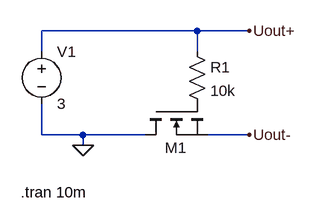
[diagram p0: schematic Securite ALIM.asc]
Securite ALIM.asc, the LTspice schematic file:
Version 4
SHEET 1 880 680
WIRE 160 80 -80 80
WIRE 240 80 160 80
WIRE -80 112 -80 80
WIRE 160 112 160 80
WIRE -80 240 -80 192
WIRE -16 240 -80 240
WIRE 80 240 -16 240
WIRE 240 240 176 240
WIRE -16 256 -16 240
FLAG -16 256 0
FLAG 240 80 Uout+
FLAG 240 240 Uout-
SYMBOL res 144 96 R0
SYMATTR InstName R1
SYMATTR Value 10k
SYMBOL nmos 80 192 M90
WINDOW 0 68 64 VLeft 2
SYMATTR InstName M1
SYMATTR Value ""
SYMBOL voltage -80 96 R0
SYMATTR InstName V1
SYMATTR Value 3
TEXT -112 328 Left 2 !.tran 10m

The netlist it stands for:
* Securite ALIM.asc
R1 Uout+ P001 10k
M1 0 P001 Uout- Uout-
V1 Uout+ 0 3
.model NMOS NMOS
.model PMOS PMOS
.lib standard.mos
.tran 10m
.backanno
.end